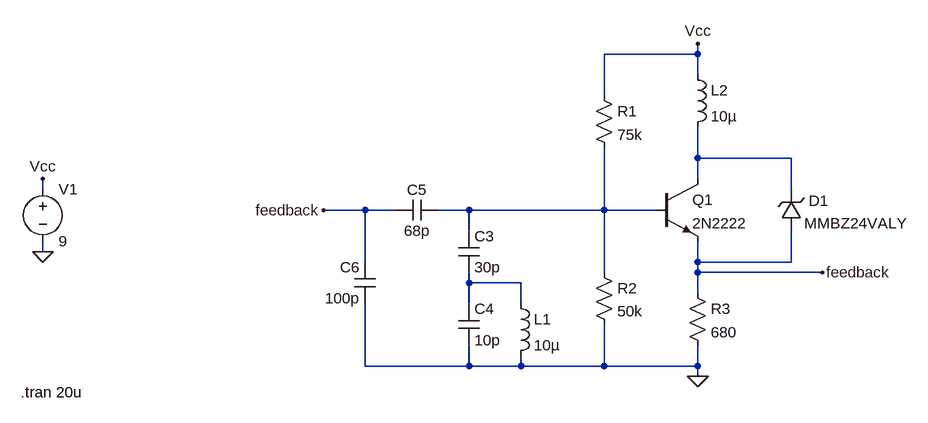
[diagram p0: schematic 10MHz_gain_controlled_oscillator.asc]
10MHz_gain_controlled_oscillator.asc, the LTspice schematic file:
Version 4
SHEET 1 880 680
WIRE 224 96 224 80
WIRE 224 96 80 96
WIRE 224 128 224 96
WIRE 80 160 80 96
WIRE 224 256 224 208
WIRE 368 256 224 256
WIRE 224 288 224 256
WIRE -784 304 -784 288
WIRE 368 304 368 256
WIRE -288 336 -352 336
WIRE -240 336 -288 336
WIRE -128 336 -176 336
WIRE 80 336 80 240
WIRE 80 336 -128 336
WIRE 160 336 80 336
WIRE -128 368 -128 336
WIRE -784 400 -784 384
WIRE -288 416 -288 336
WIRE 224 416 224 384
WIRE 368 416 368 368
WIRE 368 416 224 416
WIRE 80 432 80 336
WIRE 224 432 224 416
WIRE 416 432 224 432
WIRE -128 448 -128 432
WIRE -48 448 -128 448
WIRE 224 464 224 432
WIRE -128 480 -128 448
WIRE -48 480 -48 448
WIRE -288 576 -288 480
WIRE -128 576 -128 544
WIRE -128 576 -288 576
WIRE -48 576 -48 560
WIRE -48 576 -128 576
WIRE 80 576 80 512
WIRE 80 576 -48 576
WIRE 224 576 224 544
WIRE 224 576 80 576
WIRE 224 592 224 576
FLAG 224 592 0
FLAG 224 80 Vcc
FLAG -352 336 feedback
FLAG -784 400 0
FLAG -784 288 Vcc
FLAG 416 432 feedback
SYMBOL npn 160 288 R0
SYMATTR InstName Q1
SYMATTR Value 2N2222
SYMBOL res 64 144 R0
SYMATTR InstName R1
SYMATTR Value 75k
SYMBOL res 64 416 R0
SYMATTR InstName R2
SYMATTR Value 50k
SYMBOL res 208 448 R0
SYMATTR InstName R3
SYMATTR Value 680
SYMBOL cap -144 368 R0
SYMATTR InstName C3
SYMATTR Value 30p
SYMBOL cap -144 480 R0
SYMATTR InstName C4
SYMATTR Value 10p
SYMBOL ind -64 464 R0
SYMATTR InstName L1
SYMATTR Value 10µ
SYMBOL cap -176 320 R90
WINDOW 0 0 32 VBottom 2
WINDOW 3 32 32 VTop 2
SYMATTR InstName C5
SYMATTR Value 68p
SYMBOL cap -272 480 R180
WINDOW 0 24 56 Left 2
WINDOW 3 24 8 Left 2
SYMATTR InstName C6
SYMATTR Value 100p
SYMBOL voltage -784 288 R0
WINDOW 123 0 0 Left 0
WINDOW 39 0 0 Left 0
SYMATTR InstName V1
SYMATTR Value 9
SYMBOL zener 384 368 R180
WINDOW 0 -42 46 Left 2
WINDOW 3 -163 12 Left 2
SYMATTR InstName D1
SYMATTR Value MMBZ24VALY
SYMATTR Description Diode
SYMATTR Type diode
SYMBOL ind 208 112 R0
SYMATTR InstName L2
SYMATTR Value 10µ
TEXT -818 616 Left 2 !.tran 20u

The netlist it stands for:
* 10MHz_gain_controlled_oscillator.asc
Q1 N001 N002 feedback 0 2N2222
R1 Vcc N002 75k
R2 N002 0 50k
R3 feedback 0 680
C3 N002 N003 30p
C4 N003 0 10p
L1 N003 0 10µ
C5 N002 feedback 68p
C6 0 feedback 100p
V1 Vcc 0 9
D1 feedback N001 MMBZ24VALY
L2 Vcc N001 10µ
.model D D
.lib standard.dio
.model NPN NPN
.model PNP PNP
.lib standard.bjt
.tran 20u
.backanno
.end